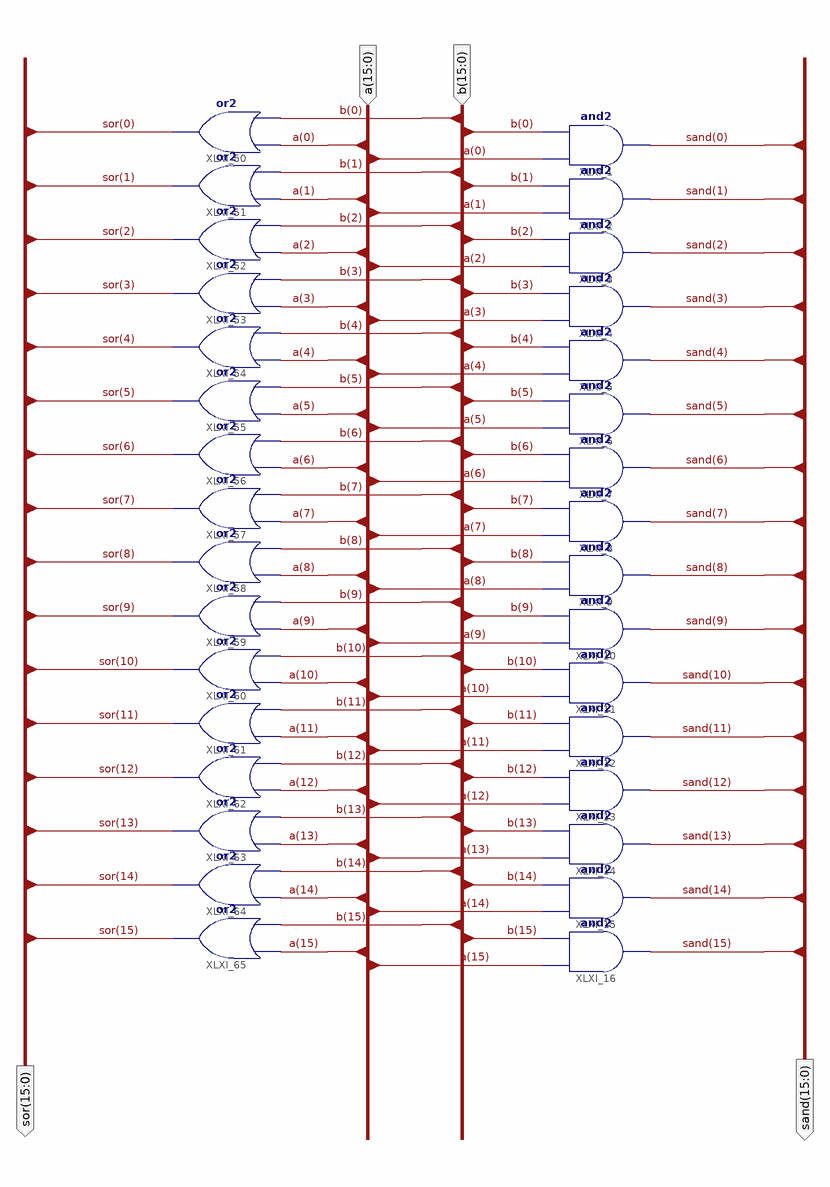
[diagram p0: schematic sheet 1]
// Xilinx ISE schematic andor.sch (spartan3e) as structural Verilog: 32 symbols, 4 ports
module andor (
  input  [15:0] a,
  input  [15:0] b,
  output [15:0] sor,
  output [15:0] sand
);

  or XLXI_50 (sor[0], a[0], b[0]);
  or XLXI_51 (sor[1], a[1], b[1]);
  or XLXI_52 (sor[2], a[2], b[2]);
  or XLXI_53 (sor[3], a[3], b[3]);
  or XLXI_54 (sor[4], a[4], b[4]);
  or XLXI_55 (sor[5], a[5], b[5]);
  or XLXI_56 (sor[6], a[6], b[6]);
  or XLXI_57 (sor[7], a[7], b[7]);
  or XLXI_58 (sor[8], a[8], b[8]);
  or XLXI_59 (sor[9], a[9], b[9]);
  or XLXI_60 (sor[10], a[10], b[10]);
  or XLXI_61 (sor[11], a[11], b[11]);
  or XLXI_62 (sor[12], a[12], b[12]);
  or XLXI_63 (sor[13], a[13], b[13]);
  or XLXI_64 (sor[14], a[14], b[14]);
  or XLXI_65 (sor[15], a[15], b[15]);
  and XLXI_1 (sand[0], a[0], b[0]);
  and XLXI_2 (sand[1], a[1], b[1]);
  and XLXI_3 (sand[2], a[2], b[2]);
  and XLXI_4 (sand[3], a[3], b[3]);
  and XLXI_5 (sand[4], a[4], b[4]);
  and XLXI_6 (sand[5], a[5], b[5]);
  and XLXI_7 (sand[6], a[6], b[6]);
  and XLXI_8 (sand[7], a[7], b[7]);
  and XLXI_9 (sand[8], a[8], b[8]);
  and XLXI_10 (sand[9], a[9], b[9]);
  and XLXI_11 (sand[10], a[10], b[10]);
  and XLXI_12 (sand[11], a[11], b[11]);
  and XLXI_13 (sand[12], a[12], b[12]);
  and XLXI_14 (sand[13], a[13], b[13]);
  and XLXI_15 (sand[14], a[14], b[14]);
  and XLXI_16 (sand[15], a[15], b[15]);
endmodule
